# Altium project Projet_1.PrjPcb
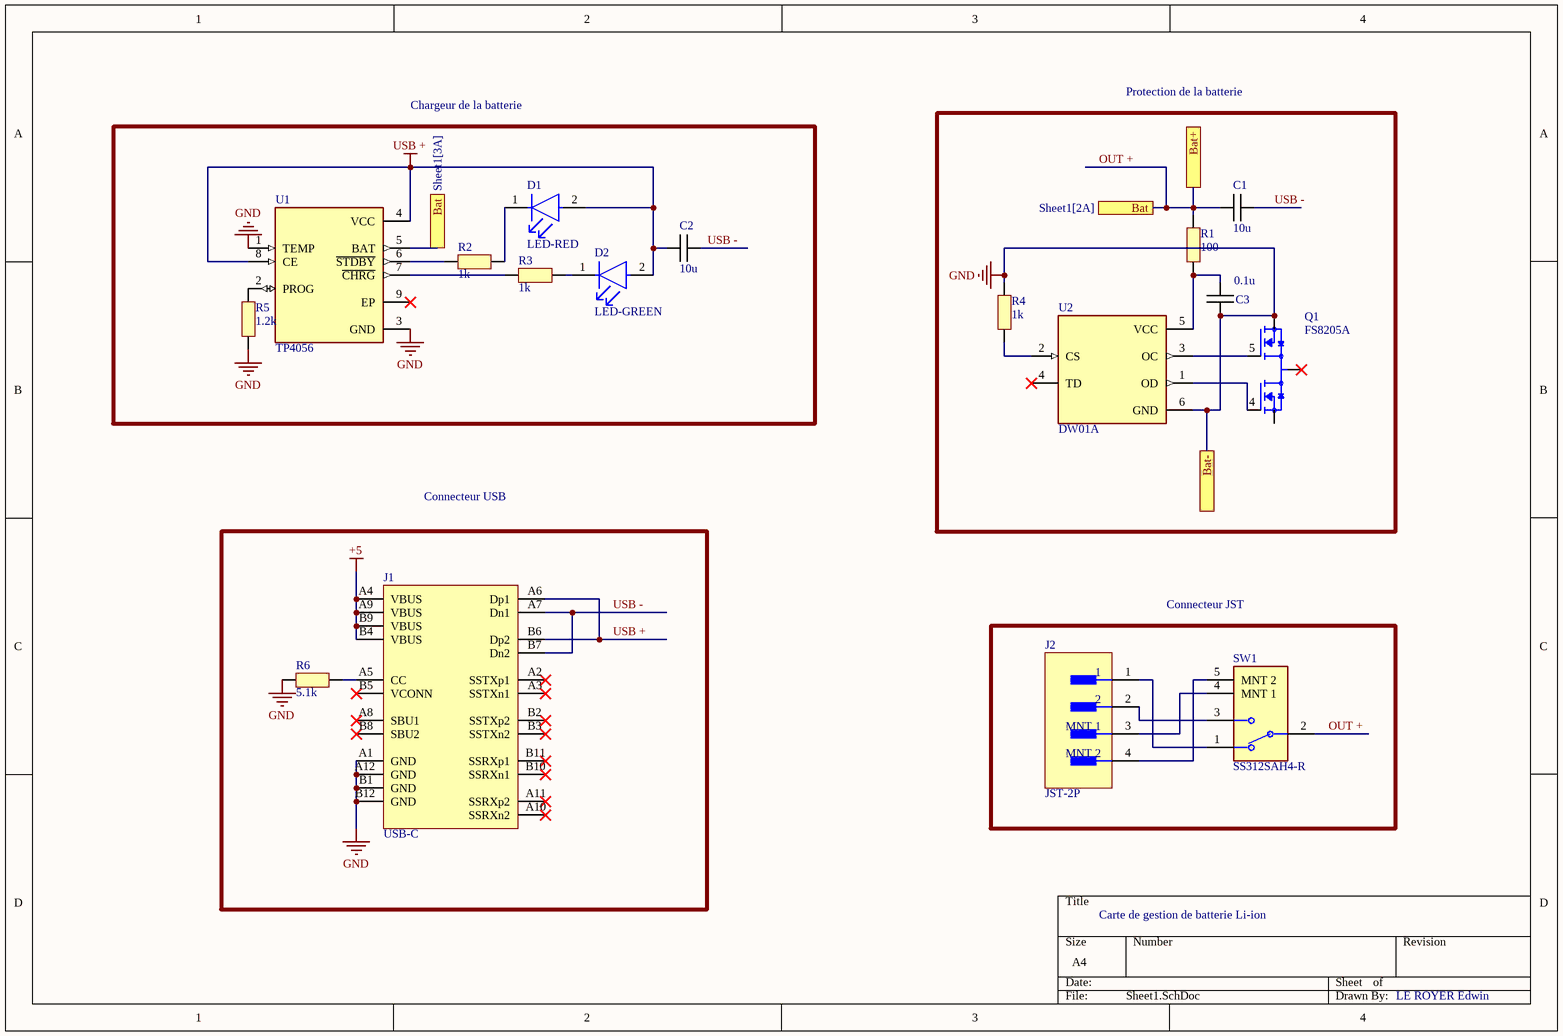
[diagram p0: Sheet1.SchDoc]
1 sheet, 17 parts. Net scope: flat (ports and power ports of the same name join across sheets).
Board file: PCB.PcbDoc

## Sheet Sheet1.SchDoc: Carte de gestion de batterie Li-ion
size A4; DrawnBy: LE ROYER Edwin; SheetNumber: 1; SheetTotal: 1

### Parts
C1  10u  [SMD-1005-CAP]
C2  10u  [SMD-1005-CAP]
C3  0.1u  [SMD-1005-CAP]
D1  LED-RED  [SMD-1608-LED]
D2  LED-GREEN  [SMD-1608-LED]
J1  USB-C  [USB-C]
J2  JST-2P  [SMD-JST-2P]
Q1  FS8205A  [FS8205A]
R1  100  [SMD-1005-RES]
R2  1k  [SMD-1005-RES]
R3  1k  [SMD-1005-RES]
R4  1k  [SMD-1005-RES]
R5  1.2k  [SMD-1005-RES]
R6  5.1k  [SMD-1005-RES]
SW1  SS312SAH4-R  [SWITCH-SLIDE-2-POS]
U1  TP4056  [SOP-8-TP4056]
U2  DW01A  [DW01A]

### Blocks framed on the sheet
Chargeur de la batterie: C2 D1 D2 R2 R3 R5 U1
Protection de la batterie: C1 C3 Q1 R1 R4 U2
Connecteur JST: J2 SW1

### Ports
Bat (see Sheet1[2A]), Bat (see Sheet1[3A]), Bat+, Bat-

### Nets
+5: J1.A4(VBUS) J1.A9(VBUS) J1.B4(VBUS) J1.B9(VBUS)
GND: C3.2 J1.A1(GND) J1.A12(GND) J1.B1(GND) J1.B12(GND) Q1.6(S2) Q1.7(S2) R4.1 R5.2 R6.1 U1.1(TEMP) U1.3(GND) U2.6(GND) ; port Bat-
USB +: C2.2 D1.2(A) D2.2(A) J1.A6(Dp1) J1.B6(Dp2) U1.4(VCC) U1.8(CE)
OUT +: C1.2 R1.1 SW1.2(COM) U1.5(BAT) ; port Bat+, port Bat
USB -: C1.1 C2.1 J1.A7(Dn1) J1.B7(Dn2)
NetC3_1: C3.1 R1.2 U2.5(VCC)
NetD1_1: D1.1(C) R2.2
NetD2_1: D2.1(C) R3.2
NetJ1_A5: J1.A5(CC) R6.2
NetJ2_1: J2.1 SW1.1
NetJ2_2: J2.2 SW1.3
NetJ2_3: J2.3(MNT_1) SW1.4(MNT_1)
NetJ2_4: J2.4(MNT_2) SW1.5(MNT_2)
NetQ1_1: Q1.1(D12) Q1.8(D12)
NetQ1_2: Q1.2(S1) Q1.3(S1)
NetQ1_4: Q1.4(G1) U2.1(OD)
NetQ1_5: Q1.5(G2) U2.3(OC)
NetR2_1: R2.1 U1.6(~{STDBY})
NetR3_1: R3.1 U1.7(~{CHRG})
NetR4_2: R4.2 U2.2(CS)
NetR5_1: R5.1 U1.2(PROG)

Not connected (* = marked no-connect by the designer): J1 A2(SSTXp1)* A3(SSTXn1)* A8(SBU1)* A10(SSRXn2)* A11(SSRXp2)* B2(SSTXp2)* B3(SSTXn2)* B5(VCONN)* B8(SBU2)* B10(SSRXn1)* B11(SSRXp1)*; U1 9(EP)*; U2 4(TD)*

### Notes on the sheet
- Connecteur USB

### Library data of the parts
C1-C3 = CAPACITOR
D1 = LED-RED: LED GREEN CLEAR CHIP SMD LTST-C190GKT; Dominant Wavelength: 569nm; Reverse Voltage: 5V; Lens Color: Colorless; Viewing Angle: 130°; Voltage: 2V; Forward Current: 30mA; Power Dissipation: 100mW; Luminous Intensity: 6mcd; Number of LEDs: 1; Forward Voltage: 2.1V; Wavelength: 565nm; Test Current: 10mA; Min Operating Temperature: -55°C; Lens Style: Clear; Mount: Surface Mount; Width: 0.8mm; Packaging: Tape and Reel; Lens Transparency: Clear; Case Code (Metric): 1608; Depth: 0.8mm; Case Code (Imperial): 0603; Case/Package: 0603; Number of Pins: 2; Max Operating Temperature: 85°C; Lead Free: Lead Free; Number of Elements: 1; Length: 1.6mm; Height: 0.8mm; Package Quantity: 1; Power Rating: 100mW; Radiation Hardening: No; Illumination Color: Green; Color: Green
D2 = LED-GREEN: LED GREEN CLEAR CHIP SMD LTST-C190GKT; Dominant Wavelength: 569nm; Reverse Voltage: 5V; Lens Color: Colorless; Viewing Angle: 130°; Voltage: 2V; Forward Current: 30mA; Power Dissipation: 100mW; Luminous Intensity: 6mcd; Number of LEDs: 1; Forward Voltage: 2.1V; Wavelength: 565nm; Test Current: 10mA; Min Operating Temperature: -55°C; Lens Style: Clear; Mount: Surface Mount; Width: 0.8mm; Packaging: Tape and Reel; Lens Transparency: Clear; Case Code (Metric): 1608; Depth: 0.8mm; Case Code (Imperial): 0603; Case/Package: 0603; Number of Pins: 2; Max Operating Temperature: 85°C; Lead Free: Lead Free; Number of Elements: 1; Length: 1.6mm; Height: 0.8mm; Package Quantity: 1; Power Rating: 100mW; Radiation Hardening: No; Illumination Color: Green; Color: Green
J1 = USB-C: NexarPartId: 68112675; Pin Length: 1.9mm; Current Rating: 5A; Gender: Receptacle; Voltage Rating: 20V; Number of Contacts: 24; Insulation Resistance: 1GΩ; USB Standard: USB 3.1; Connector Type: USB; Contact Resistance: 30mΩ; Min Operating Temperature: -40°C; Mount: Surface Mount, Through Hole; Height: 3.21mm; Number of Pins: 24; RoHS: Compliant; Orientation: Horizontal; Max Operating Temperature: 105°C; Packaging: Tape and Reel; Contact Material: Gold, Nickel
J2 = JST-2P: Connector Header Surface Mount, Right Angle 2 position 0.079" (2.00mm); NexarPartId: 22059567; Number of Contacts: 2; Gender: Male; Voltage Rating: 250V; Current Rating: 3A; Packaging: Cut Tape; Height: 5.7mm; Max Operating Temperature: 85°C; Mount: Surface Mount; Termination: SMD/SMT; Min Operating Temperature: -25°C; Number of Rows: 1; Contact Plating: Tin; Lead Free: Lead Free; RoHS: Compliant; Contact Material: Copper
Q1 = FS8205A: N/A; MF: Fortune Semiconductor; MP: FS8205A; Value: *; Availability: Not in stock; Package: Package; Price: None; SnapEDA_Link: https://www.snapeda.com/parts/FS8205A/Fortune+Semiconductor/view-part/?ref=snap; Check_prices: https://www.snapeda.com/parts/FS8205A/Fortune+Semiconductor/view-part/?ref=eda
R1-R6 = RESISTOR
SW1 = SWITCH-SLIDE-SPDT: SWITCH SLIDE SPDT 0.4VA 28V; Mechanical Life: 10000Cycles; Switch Function: On-On; Actuator Length: 2mm; Contact Style: Shorting; Max Current Rating: 100mA; Actuator Type: Standard; Actuator Material: Polyphenylene; Length: 10.5mm; Orientation: Right Angle; Voltage Rating (DC): 28V; Contact Material: Bronze; Electrical Life: 10000Cycles; Max Operating Temperature: 85°C; Case/Package: SMD/SMT; Depth: 7.45mm; Contact Plating: Gold; Voltage Rating (AC): 28V; Package Quantity: 1; Min Operating Temperature: -25°C; Switch Travel: 2mm; Housing Material: Bronze; RoHS Compliant: Yes; Lead Free: Lead Free; Termination: Gull Wing; Packaging: Tape and Reel; REACH SVHC: No SVHC; Mount: Surface Mount; Series: SS3; Throw Configuration: SPDT; Max Voltage Rating (AC): 28V; Max Voltage Rating (DC): 28V
U1 = TP4056: Complete single cell Li-Ion battery with a constant current / constant voltage linear charger; MF: NanJing Top Power ASIC Corp.; Check_prices: https://www.snapeda.com/parts/TP4056/NanJing+Top+Power+ASIC+Corp./view-part/?ref=eda; SnapEDA_Link: https://www.snapeda.com/parts/TP4056/NanJing+Top+Power+ASIC+Corp./view-part/?ref=snap; Price: None; Availability: Not in stock; Package: Package; MP: TP4056; Value: *
U2 = DW01A: One Cell Lithium-ion/Polymer Battery Protection IC; MF: Fortune Semiconductor; SnapEDA_Link: https://www.snapeda.com/parts/DW01A/Fortune+Semiconductor/view-part/?ref=snap; Package: SOT-23-6 Fortune Semiconductor; Value: *; MP: DW01A; Check_prices: https://www.snapeda.com/parts/DW01A/Fortune+Semiconductor/view-part/?ref=eda